# Altium schematic sheet PP3_MMC.SchDoc
size 149 x 100 mm
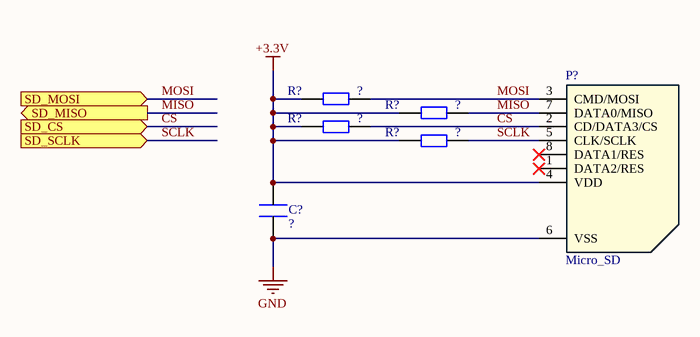
[diagram p0: PP3_MMC.SchDoc]

## Parts
(Parts that share a designator on the sheet are numbered #1, #2 ... from top to bottom, then left to right.)
C?  Condo  (value not drawn)  (no BOM)
P?  Micro_SD
R?#1  Res  (value not drawn)  (no BOM)
R?#2  Res  (value not drawn)  (no BOM)
R?#3  Res  (value not drawn)  (no BOM)
R?#4  Res  (value not drawn)  (no BOM)

## Ports
SD_CS (in), SD_MISO (out), SD_MOSI (in), SD_SCLK (in)

## Nets
+3.3V: C?.2 P?.4(VDD) R?#1.1 R?#2.1 R?#3.1 R?#4.1
GND: C?.1 P?.6(VSS)
CS: P?.2(CD/DATA3/CS) R?#3.2 ; port SD_CS
MISO: P?.7(DATA0/MISO) R?#2.2 ; port SD_MISO
MOSI: P?.3(CMD/MOSI) R?#1.2 ; port SD_MOSI
SCLK: P?.5(CLK/SCLK) R?#4.2 ; port SD_SCLK

Not connected (* = marked no-connect by the designer): P? 1(DATA2/RES)* 8(DATA1/RES)*

## Library data of the parts
C? = Condo: Condensateur; Valeur: ?
P? = Micro_SD: Embase de Carte SD
R?#1-R?#4 = Res: Résistance; Valeur: ?